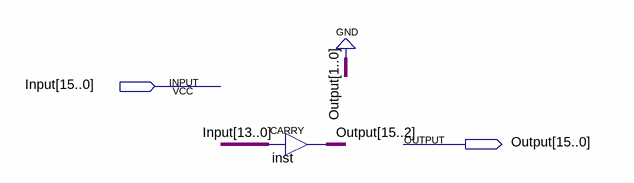
[diagram p0: schematic sheet]
// Quartus schematic Shift_Left_2bit.bdf as structural Verilog: 1 symbols, 2 pins
module Shift_Left_2bit (
  input  [15:0] Input,
  output [15:0] Output
);

  CARRY inst[13:0] (.IN(Input[13:0]), .OUT(Output[15:2]));

  assign Output[1:0] = 2'b00;
endmodule
